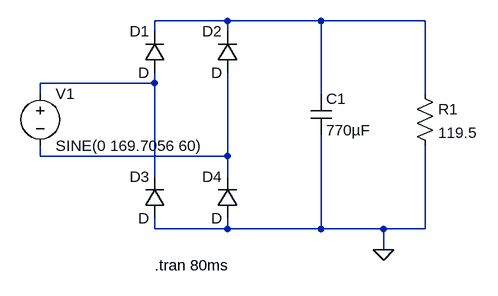
[diagram p0: schematic 4diode-120VAC-60Hz-770uF-119.5Ohm.asc]
4diode-120VAC-60Hz-770uF-119.5Ohm.asc, the LTspice schematic file:
Version 4
SHEET 1 880 680
WIRE 256 96 144 96
WIRE 400 96 256 96
WIRE 560 96 400 96
WIRE 144 112 144 96
WIRE 256 112 256 96
WIRE 144 192 144 176
WIRE 144 192 -32 192
WIRE -32 208 -32 192
WIRE 400 208 400 96
WIRE 560 208 560 96
WIRE -32 304 -32 288
WIRE 256 304 256 176
WIRE 256 304 -32 304
WIRE 144 336 144 192
WIRE 256 336 256 304
WIRE 144 416 144 400
WIRE 256 416 256 400
WIRE 256 416 144 416
WIRE 400 416 400 272
WIRE 400 416 256 416
WIRE 496 416 400 416
WIRE 560 416 560 288
WIRE 560 416 496 416
WIRE 496 448 496 416
FLAG 496 448 0
SYMBOL diode 160 176 R180
WINDOW 0 24 64 Left 2
WINDOW 3 24 0 Left 2
SYMATTR InstName D1
SYMBOL diode 272 176 R180
WINDOW 0 24 64 Left 2
WINDOW 3 24 0 Left 2
SYMATTR InstName D2
SYMBOL diode 160 400 R180
WINDOW 0 24 64 Left 2
WINDOW 3 24 0 Left 2
SYMATTR InstName D3
SYMBOL diode 272 400 R180
WINDOW 0 24 64 Left 2
WINDOW 3 24 0 Left 2
SYMATTR InstName D4
SYMBOL voltage -32 192 R0
WINDOW 123 0 0 Left 2
WINDOW 39 0 0 Left 2
SYMATTR InstName V1
SYMATTR Value SINE(0 169.7056 60)
SYMBOL cap 384 208 R0
SYMATTR InstName C1
SYMATTR Value 770µF
SYMBOL res 544 192 R0
SYMATTR InstName R1
SYMATTR Value 119.5
TEXT 144 472 Left 2 !.tran 80ms

The netlist it stands for:
* 4diode-120VAC-60Hz-770uF-119.5Ohm.asc
D1 N002 N001 D
D2 N003 N001 D
D3 0 N002 D
D4 0 N003 D
V1 N002 N003 SINE(0 169.7056 60)
C1 N001 0 770µF
R1 N001 0 119.5
.model D D
.lib standard.dio
.tran 80ms
.backanno
.end